# EAGLE schematic 1Sheeld PLUS_REV3 (EAGLE 7.5.0)
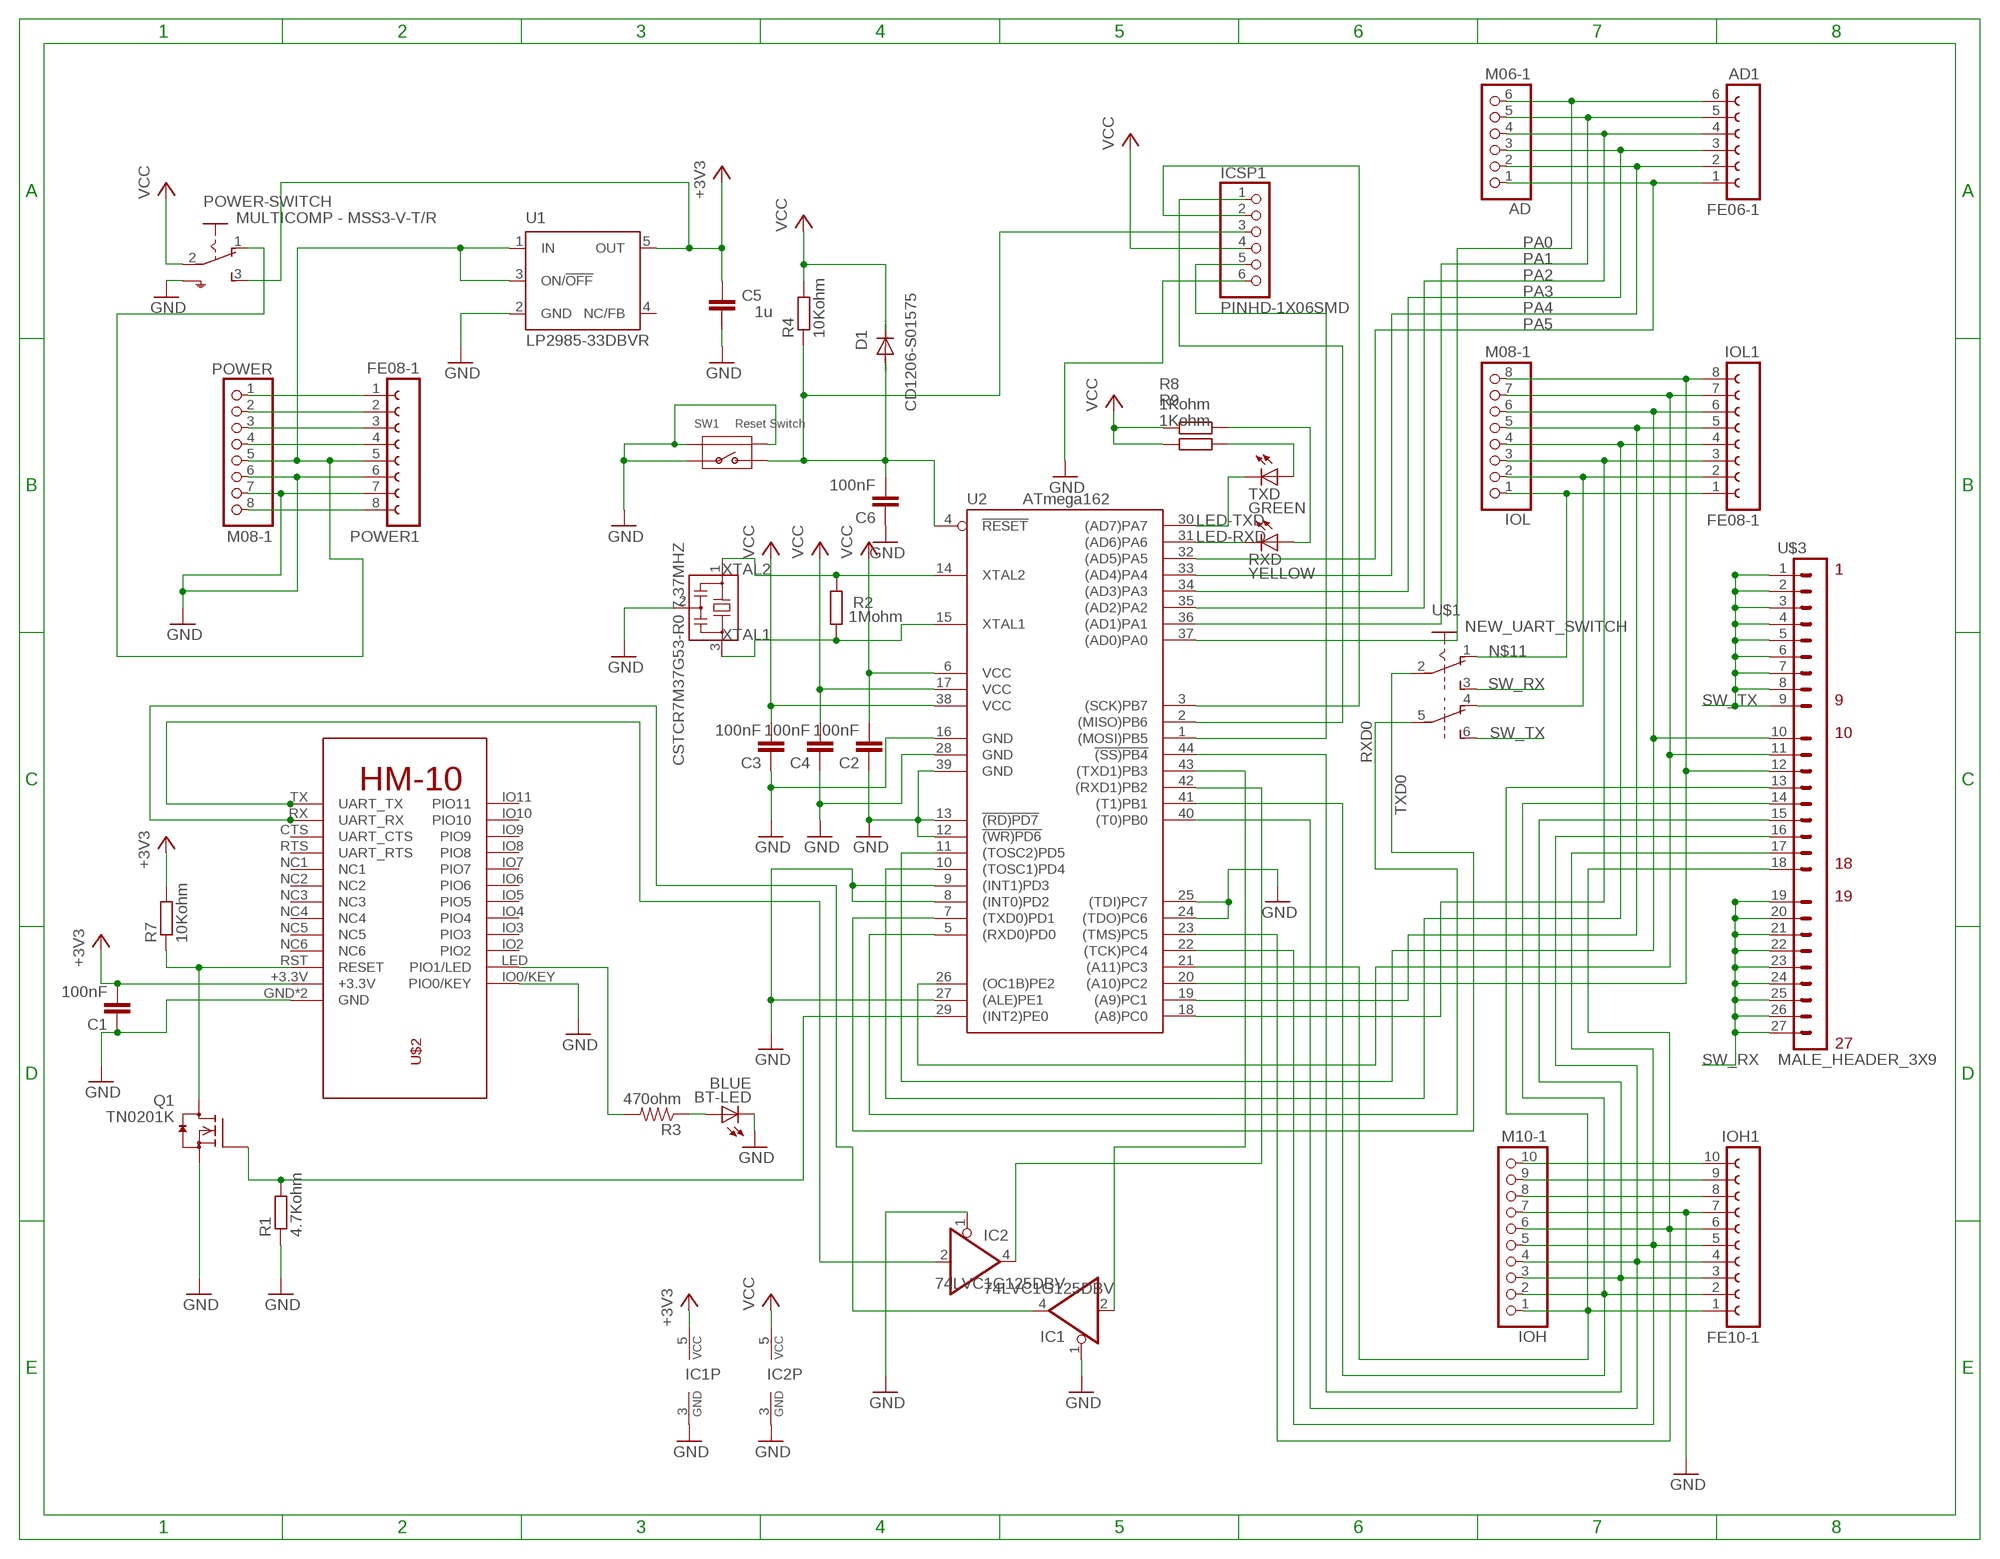
[diagram p0: schematic, sheet 1]

## Parts
AD  M06-1  PINHD-1X6  [1X06]
AD1  FE06-1  [FE06]
BT-LED  BLUE  LEDCHIP-LED0805  [CHIP-LED0805]
C1  100nF  C-EU0603-RND  [C0603-ROUND]
C2  100nF  C-EU0603-RND  [C0603-ROUND]
C3  100nF  C-EU0603-RND  [C0603-ROUND]
C4  100nF  C-EU0603-RND  [C0603-ROUND]
C5  1u  C-EU0603-RND  [C0603-ROUND]
C6  100nF  C-EU0603-RND  [C0603-ROUND]
D1  CD1206-S01575  DIODE-MINIMELF  [MINIMELF]
IC1  74LVC1G125DBV  [SOT23-5]
IC2  74LVC1G125DBV  [SOT23-5]
ICSP1  PINHD-1X06SMD  [1X06/90SMD]
IOH  M10-1  PINHD-1X10_ARD  [1X10]
IOH1  FE10-1  [FE10]
IOL  M08-1  PINHD-1X8  [1X08]
IOL1  FE08-1  [FE08]
POWER  M08-1  PINHD-1X8  [1X08]
POWER1  FE08-1  [FE08]
POWER-SWITCH  MULTICOMP - MSS3-V-T/R  SWITCHMULTI  [SWITCHMULTI]
Q1  TN0201K  [SOT23]
R1  4.7Kohm  R-EU_M0805  [M0805]
R2  1Mohm  R-EU_R0603  [R0603-ROUND]
R3  470ohm  RESISTOR0402-RES  [0402-RES]
R4  10Kohm  R-EU_M0805  [M0805]
R7  10Kohm  R-EU_M0805  [M0805]
R8  1Kohm  R-EU_R0603  [R0603-ROUND]
R9  1Kohm  R-EU_R0603  [R0603-ROUND]
RXD  YELLOW  LEDCHIP-LED0805  [CHIP-LED0805]
SW1  Reset Switch  DISCRETE_BUTTON-4P-REINFORCETS-1188E  [DISCRETE_4P-SMD-7X3.5X3.5H]
TXD  GREEN  LEDCHIP-LED0805  [CHIP-LED0805]
U1  LP2985-33DBVR  LP2985-XXDBVR33  [SOT23-DBV]
U2  ATmega162  ATMEGA162  [TQFP44]
U$1  NEW_UART_SWITCH  [NEW_UART_SWITCH]
U$2  HM-10  [HM-10]
U$3  MALE_HEADER_3X9  [MALE_HEADER_3X9]
Y1  CSTCR7M37G53-R0 7.37MHZ  CSTCR6M00G53Z  [CSTCR6M]

## Nets
+3.3V: C1.2 C5.2 IC1.5(VCC) POWER-SWITCH.3(S) R7.2 U1.5(OUT) U$2.+3.3V ; supply symbol labelled +3V3
+5V: POWER1.5 POWER-SWITCH.1(O) POWER.5 U1.1(IN) U1.3(ON/!OFF)
BT-LED: R3.2 U$2.LED(PIO1/LED)
GND: BT-LED.C C1.1 C2.1 C3.1 C4.1 C5.1 C6.1 IC1.1(OE) IC1.3(GND) IC2.1(OE) IC2.3(GND) ICSP1.6 IOH1.7 IOH.7 POWER1.6 POWER1.7 POWER-SWITCH.P$4(SH) POWER-SWITCH.P$5(SH) POWER-SWITCH.P$6(SH) POWER-SWITCH.P$7(SH) POWER.6 POWER.7 Q1.2(S) R1.1 SW1.1 SW1.S1 SW1.S2 U1.2(GND) U2.8((INT0)PD2) U2.9((INT1)PD3) U2.12(!(WR)PD6) U2.13(!(RD)PD7) U2.16(GND) U2.24((TDO)PC6) U2.25((TDI)PC7) U2.27((ALE)PE1) U2.28(GND) U2.39(GND) U$2.GND U$2.GND2(GND) U$2.IO0/KEY Y1.2
LED-RXD: RXD.C U2.31((AD6)PA6)
LED-TXD: TXD.C U2.30((AD7)PA7)
N$1: IOH1.10 IOH.10
N$2: IOH1.9 IOH.9
N$3: BT-LED.A R3.1
N$4: POWER1.2 POWER.2
N$5: POWER1.4 POWER.4
N$6: ICSP1.5 U2.1((MOSI)PB5)
N$7: IOH1.1 IOH.1 U2.21((A11)PC3) U$3.13
N$8: IOH1.3 IOH.3 U2.44(!(SS)PB4) U$3.15
N$9: IC2.4(O) U2.42((RXD1)PB2)
N$10: IC2.2(I) U$2.TX(UART_TX)
N$11: IOL1.1 IOL.1 U$1.1
N$17: POWER1.8 POWER.8
N$19: IOH1.2 IOH.2 U2.41((T1)PB1) U$3.14
N$20: ICSP1.1 U2.2((MISO)PB6)
N$22: POWER1.3 POWER.3
N$23: ICSP1.2 U2.3((SCK)PB7)
N$24: POWER1.1 POWER.1
N$26: IC1.4(O) U$2.RX(UART_RX)
N$27: IOL1.3 IOL.3 U2.18((A8)PC0)
N$28: IOL1.4 IOL.4 U2.10((TOSC1)PD4)
N$29: IOL1.5 IOL.5 U2.19((A9)PC1)
N$30: IOL1.6 IOL.6 U2.11((TOSC2)PD5) U$3.10
N$31: IOL1.7 IOL.7 U2.26((OC1B)PE2) U$3.11
N$32: IOL1.8 IOL.8 U2.20((A10)PC2) U$3.12
N$33: IOH1.4 IOH.4 U2.40((T0)PB0) U$3.16
N$34: IOH1.8 IOH.8
N$37: IOH1.6 IOH.6 U2.23((TMS)PC5) U$3.18
N$38: IOH1.5 IOH.5 U2.22((TCK)PC4) U$3.17
N$40: IC1.2(I) U2.43((TXD1)PB3)
N$41: IOL1.2 IOL.2 U$1.4
N$42: R9.1 TXD.A
N$45: Q1.3(D) R7.1 U$2.RST(RESET)
N$46: Q1.1(G) R1.2 U2.29((INT2)PE0)
N$47: R8.1 RXD.A
PA0: AD1.6 AD.6 U2.37((AD0)PA0)
PA1: AD1.5 AD.5 U2.36((AD1)PA1)
PA2: AD1.4 AD.4 U2.35((AD2)PA2)
PA3: AD1.3 AD.3 U2.34((AD3)PA3)
PA4: AD1.2 AD.2 U2.33((AD4)PA4)
PA5: AD1.1 AD.1 U2.32((AD5)PA5)
RESET: C6.2 D1.A ICSP1.3 R4.1 SW1.2 U2.4(!RESET)
RXD0: U2.5((RXD0)PD0) U$1.5
SW_RX: U$1.3 U$3.19 U$3.20 U$3.21 U$3.22 U$3.23 U$3.24 U$3.25 U$3.26 U$3.27
SW_TX: U$1.6 U$3.1 U$3.2 U$3.3 U$3.4 U$3.5 U$3.6 U$3.7 U$3.8 U$3.9
TXD0: U2.7((TXD0)PD1) U$1.2
VCC: C2.2 C3.2 C4.2 D1.C IC2.5(VCC) ICSP1.4 POWER-SWITCH.2(P) R4.2 R8.2 R9.2 U2.6(VCC) U2.17(VCC) U2.38(VCC)
XTAL1: R2.1 U2.15(XTAL1) Y1.3
XTAL2: R2.2 U2.14(XTAL2) Y1.1
Unconnected: U1.4(NC/FB) U$2.CTS(UART_CTS) U$2.IO2 U$2.IO3 U$2.IO4 U$2.IO5 U$2.IO6 U$2.IO7 U$2.IO8 U$2.IO9 U$2.IO10 U$2.IO11 U$2.NC1 U$2.NC2 U$2.NC3 U$2.NC4 U$2.NC5 U$2.NC6 U$2.RTS(UART_RTS)

## Library data of the parts
AD = SmartPrj:PINHD-1X6: PIN HEADER
AD1 = Tolba-con-lsta:FE06-1: FEMALE HEADER; OC_FARNELL: unknown; OC_NEWARK: unknown
BT-LED RXD TXD = led:LED: LED OSRAM: - CHIPLED LG R971, LG N971, LY N971, LG Q971, LY Q971, LO R971, LY R971 LH N974, LH R974 LS Q976, LO Q976, LY Q976 LO Q996 - Hyper CHIPLED LW Q18S LB Q993, LB Q99A, LB R99A - SideLED LS A670, LO A670, LY A670, LG A670, LP A670 LB A673, LV A673, LT A673, LW A673 LH A674 LY A675 LS A676, LA A676, LO A676, LY A676, LW A676 LS A679, LY A679, LG A679 - Hyper Micro SIDELED® LS Y876, LA Y876, LO Y876, LY Y876 LT Y87S - SmartLED LW L88C, LW L88S LB L89C, LB L89S, LG L890 LS L89K, LO L89K, LY L89K LS L896, LA L896, LO L896, LY L896 - TOPLED LS T670, LO T670, LY T670, LG T670, LP T670 LSG T670, LSP T670, LSY T670, LOP T670, LYG T670 LG T671, LOG T671, LSG T671 LB T673, LV T673, LT T673, LW T673 LH T674 LS T676, LA T676, LO T676, LY T676, LB T676, LH T676, LSB T676, LW T676 LB T67C, LV T67C, LT T67C, LS T67K, LO T67K, LY T67K, LW E67C LS E67B, LA E67B, LO E67B, LY E67B, LB E67C, LV E67C, LT E67C LW T67C LS T679, LY T679, LG T679 LS T770, LO T770, LY T770, LG T770, LP T770 LB T773, LV T773, LT T773, LW T773 LH T774 LS E675, LA E675, LY E675, LS T675 LS T776, LA T776, LO T776, LY T776, LB T776 LHGB T686 LT T68C, LB T68C - Hyper Mini TOPLED® LB M676 - Mini TOPLED Santana® LG M470 LS M47K, LO M47K, LY M47K Source: http://www.osram.convergy.de LUXEON: - LUMILED® LXK2-PW12-R00, LXK2-PW12-S00, LXK2-PW14-U00, LXK2-PW14-V00 LXK2-PM12-R00, LXK2-PM12-S00, LXK2-PM14-U00 LXK2-PE12-Q00, LXK2-PE12-R00, LXK2-PE12-S00, LXK2-PE14-T00, LXK2-PE14-U00 LXK2-PB12-K00, LXK2-PB12-L00, LXK2-PB12-M00, LXK2-PB14-N00, LXK2-PB14-P00, LXK2-PB14-Q00 LXK2-PR12-L00, LXK2-PR12-M00, LXK2-PR14-Q00, LXK2-PR14-R00 LXK2-PD12-Q00, LXK2-PD12-R00, LXK2-PD12-S00 LXK2-PH12-R00, LXK2-PH12-S00 LXK2-PL12-P00, LXK2-PL12-Q00, LXK2-PL12-R00 Source: www.luxeon.com KINGBRIGHT: KA-3528ASYC Source: www.kingbright.com
C1-C6 = SmartPrj:C-EU: CAPACITOR, European symbol
D1 = diode:DIODE-: DIODE
IC1 IC2 = 74xx-little-de:74*1G125: Single Bus Buffer Gate with 3-State Output
ICSP1 = pinhead:PINHD-1X06SMD
IOH = SmartPrj:PINHD-1X10_ARD: PIN HEADER
IOH1 = Tolba-con-lsta:FE10-1: FEMALE HEADER; OC_FARNELL: unknown; OC_NEWARK: unknown
IOL POWER = SmartPrj:PINHD-1X8: PIN HEADER
IOL1 POWER1 = Tolba-con-lsta:FE08-1: FEMALE HEADER; OC_FARNELL: unknown; OC_NEWARK: unknown
POWER-SWITCH = switch:SWITCHMULTI
Q1 = m-pad-2.1:TN0201K
R1 R4 R7 = rcl:R-EU_: RESISTOR, European symbol
R2 R8 R9 = SmartPrj:R-EU_: RESISTOR, European symbol
R3 = SparkFun:RESISTOR: Resistor Basic schematic elements and footprints for 0603, 1206, and PTH 1/10th watt (small) resistors.
SW1 = Seeed_Bluetooth Shield v2.0:DISCRETE_BUTTON-4P-REINFORCE: TS-1188E http://www.best-dz.com/?thread-374-2.html
U1 = SmartPrj:LP2985-XXDBVR: ULTRALOW-POWER 50-mA LOW-DROPOUT LINEAR REGULATORS 50-mA Low-Dropout Regulator Source: http://focus.ti.com/lit/ds/symlink/tps77001.pdf
U2 = ATmega162:ATMEGA162
U$1 = 1sheeld:NEW_UART_SWITCH
U$2 = HM-10:HM-10
U$3 = 3X9 Pin Header:MALE_HEADER_3X9
Y1 = murata-filter:CSTCR: Resonator Source: murata.co.jp; MPN: CSTCR6M00G53-R0; OC_FARNELL: 1170434; OC_NEWARK: 25M8759

## Net classes
0 default: width 0.254 mm, clearance 0.254 mm
3 usbvcc: width 0.508 mm, drill 0.61 mm, clearance 0.254 mm